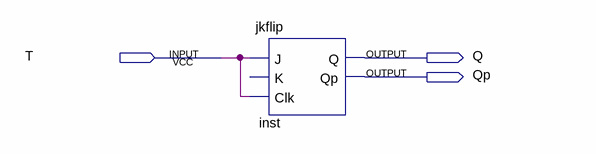
[diagram p0: schematic sheet]
// Quartus schematic T_JK.bdf as structural Verilog: 1 symbols, 3 pins
module T_JK (
  input  T,
  output Q,
  output Qp
);

  jkflip inst (.J(T), .Clk(T), .Q(Q), .Qp(Qp));  // open: K
endmodule
